# Altium project SPEC_A7.PrjPcb (part 7 of 7)

## Sheet PPS_IN.SchDoc: SPEC-A7
size 420 x 297 mm; Author: G.Kasprowicz; CompanyName: WUT ISE; DrawnBy: G.Kasprowicz; Organization: WUT ISE; Address1: PW ISE; Address2: Nowowiejska 15/19 00-665 Warsaw; Address3: gkasprow@gmail.com; Revision: 2; SheetNumber: 18; SheetTotal: 18; ModifiedBy: -; CheckedDate: -; Title2: PPS IN; DivGrp: WUT ISE; Designer: G.Kasprowicz; ModifiedDate: -; ProjectName: Sensor Box
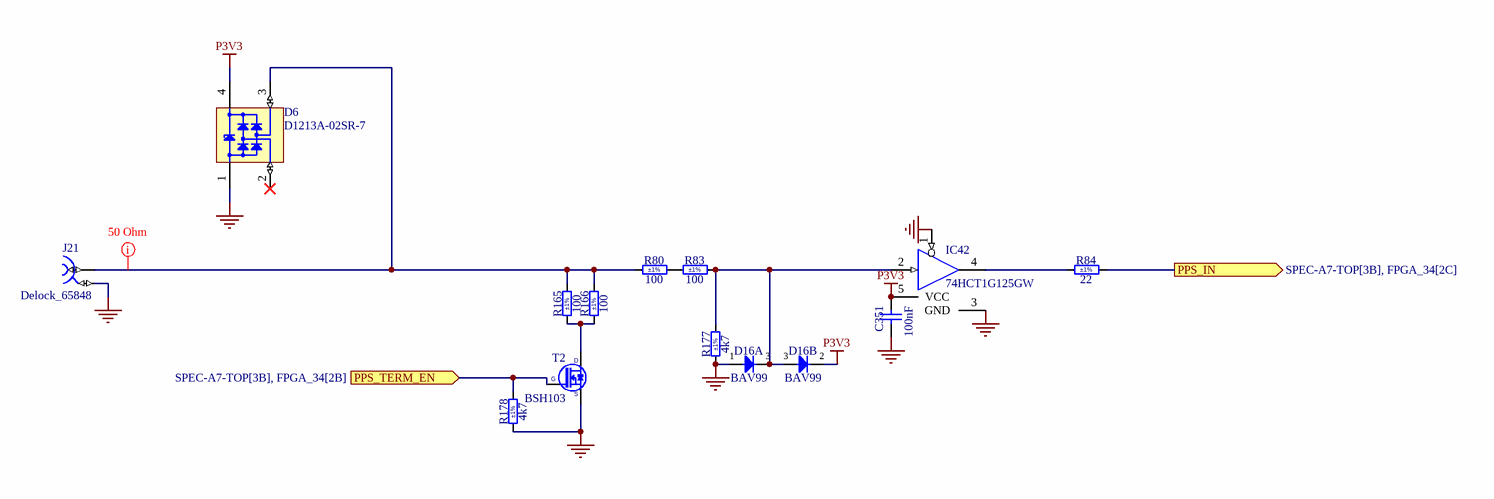
[diagram p17: PPS_IN.SchDoc]

### Parts
C351  100nF  [CAPC0603X33N]
D6  D1213A-02SR-7  [SOT190P238X100-4N]
D16  BAV99  [SOT95P240X110-3N]  (parts A,B of 2)
IC42  74HCT1G125GW  [SOT65P210X110-5N]
J21  Delock_65848  [Delock_65848]
R80  100  Tolerance: ±1%  [RESC1005X40N]
R83  100  Tolerance: ±1%  [RESC1005X40N]
R84  22  Tolerance: ±1%  [RESC1005X40N]
R165  100  Tolerance: ±1%  [RESC1005X40N]
R166  100  Tolerance: ±1%  [RESC1005X40N]
R177  4k7  Tolerance: ±1%  [RESC1005X40N]
R178  4k7  Tolerance: ±1%  [RESC1005X40N]
T2  BSH103  [SOT95P230X110-3N]

### Ports
PPS_IN (out, see SPEC-A7-TOP[3B], FPGA_34[2C]), PPS_TERM_EN (in, see SPEC-A7-TOP[3B], FPGA_34[2B])

### Nets
GND: C351.1 D6.1(GND) D16.1(A) IC42.1(~{G}) IC42.3(GND) J21.2 R177.1 R178.1 T2.2(S)
P3V3: C351.2 D6.4(VCC) D16.2(C) IC42.5(VCC)
PPS_IN: R84.2 ; port PPS_IN
NetD6_3: D6.3(I/O2) J21.1 R80.1 R165.2 R166.2
NetD16_3: D16.3(COMAC) IC42.2(IN) R83.2 R177.2
NetIC4_L2: R178.2 T2.1(G) ; port PPS_TERM_EN
NetIC42_4: IC42.4(OUT) R84.1
NetR80_2: R80.2 R83.1
NetR165_1: R165.1 R166.1 T2.3(D)

Not connected (* = marked no-connect by the designer): D6 2(I/O1)*

### Layout directives
net class 50_Ohm: NetD6_3

### Notes on the sheet
- Project/Equipment
- Document
- Designer
- Drawn by
- Check.by
- Copyright WUT ISE 2024.
  This documentation describes Open Hardware and is licensed under the CERN OHL v.2. You may redistribute and modify this documentation under the terms of the CERN OHL v.2. (http://ohwr.org/CERNOHL). This documentation is distributed WITHOUT ANY EXPRESS OR IMPLIED WARRANTY, INCLUDING OF MERCHANTABILITY, SATISFACTORY QUALITY AND FITNESS FOR A PARTICULAR PURPOSE. Please see the CERN OHL v.2 for applicable conditions.
- Contact
- File
- Last Mod.
- Print Date
- Sheet
- Size
- A3
- of
- Rev

### Library data of the parts
C351 = CC0201_100NF_6.3V_10%_X5R: as C57-C66 on sheet FPGA_PWR_CONFIG; Part Number: CC0201_100NF_6.3V_10%_X5R; Component Kind: Standard; Component Type: Standard; Pin Count: 2; Value: 100nF; Status: Not Recommended; Manufacturer Part Number: CC0201_100NF_6.3V_10%_X5R; Case: 0201; Mounted: Yes; Socket: No; SMD: Yes; Sense: No; Manufacturer1 Example: AVX; Manufacturer1 ComponentHeight: 0.33mm; HelpURL: \\cern.ch\dfs\Applications\Altium\Datasheets\CC0201_X5R_AVX.pdf; Author: CERN DEM JLC; CreateDate: 03.12.2007; LatestRevisionDate: 03.12.2007
D6 = CMP-004-00039-1: D1213A-02SR Series 400 mW Uni-Directional Surface Mount TVS Diode - SOT-143; Mounting Technology: Surface Mount; Case/Package: SOT-143; Max Operating Temperature: 150°C; Pins: 4; Min Operating Temperature: -65°C
D16 = BAV99: Serial Diode; Part Description: Dual Series Signal Diode; Manufacturer: FAIRCHILD SEMICONDUCTOR; Voltage: 70V; Power: 350mW; PressFit: No; Bonding: No; Part Number: BAV99; Component Kind: Standard; Component Type: Standard; Device: BAV99; PackageDescription: SOT, 0.95mm Pitch; 3 Pin, 1.40mm W X 3.00mm L X 1.10mm H body, IPC Medium Density; Manufacturer Part Number: BAV99; Pin Count: 3; Case: SOT23-3; Mounted: Yes; Socket: No; SMD: Yes; Sense: No; ComponentHeight: 1.1mm; HelpURL: \\cern.ch\dfs\Applications\Altium\Datasheets\BAV99.pdf; Author: CERN DEM JLC; CreateDate: 06.05.2008; LatestRevisionDate: 27.09.2012
IC42 = 74HCT1G125GW: Single Bus Buffer Gate With 3-State Output; Part Description: Bus Buffer/Line Driver 3-State; Manufacturer: NEXPERIA; PressFit: No; Bonding: No; Part Number: 74HCT1G125GW; Component Kind: Standard; Component Type: Standard; Device: 74HCT1G125GW; PackageDescription: SOT353, SC70-5, 0.65mm Pitch; 5 Pin, 1.25mm W X 2.00mm L X 1.10mm H body, IPC Medium Density; Manufacturer Part Number: 74HCT1G125GW; Pin Count: 5; Case: SOT353; Mounted: Yes; Socket: No; SMD: Yes; Sense: No; ComponentHeight: 1.1mm; Author: CERN DEM JMW; HelpURL: \\cern.ch\dfs\Applications\Altium\Datasheets\74HCT1G125GW.pdf; CreateDate: 06.08.2020; LatestRevisionDate: 06.08.2020
J21 = CMP-002-04652-1: SMA connector Delock 65848
R80 R83 R165 R166 = R0402_100R_1%_0.0625W_100PPM: Resistor - 1%; Part Description: General Purpose Thick Film Chip Resistor; Manufacturer: GENERIC; Manufacturer1 Part Number: 232270671001L; TC: ±100ppm/°C; PressFit: No; Part Number: R0402_100R_1%_0.0625W_100PPM; Component Kind: Standard; Component Type: Standard; Pin Count: 2; Value: 100; Status: Not Recommended; Power: 0.0625W; Manufacturer Part Number: R0402_100R_1%_0.0625W_100PPM; Case: 0402; Mounted: Yes; Sense: No; Socket: No; SMD: Yes; Manufacturer1 Example: YAGEO PHYCOMP; Manufacturer1 ComponentHeight: 0.4mm; HelpURL: \\cern.ch\dfs\Applications\Altium\Datasheets\R0402_Phycomp_RC0402.pdf; Author: CERN DEM JLC; CreateDate: 03.12.2007; LatestRevisionDate: 17.10.2012
R84 = R0402_22R_1%_0.0625W_100PPM: Resistor - 1%; Part Description: General Purpose Thick Film Chip Resistor; Manufacturer: GENERIC; Manufacturer1 Part Number: 232270672209L; TC: ±100ppm/°C; PressFit: No; Part Number: R0402_22R_1%_0.0625W_100PPM; Component Kind: Standard; Component Type: Standard; Pin Count: 2; Value: 22; Status: Not Recommended; Power: 0.0625W; Manufacturer Part Number: R0402_22R_1%_0.0625W_100PPM; Case: 0402; Mounted: Yes; Sense: No; Socket: No; SMD: Yes; Manufacturer1 Example: YAGEO PHYCOMP; Manufacturer1 ComponentHeight: 0.4mm; HelpURL: \\cern.ch\dfs\Applications\Altium\Datasheets\R0402_Phycomp_RC0402.pdf; Author: CERN DEM JLC; CreateDate: 03.12.2007; LatestRevisionDate: 17.10.2012
R177 R178 = R0402_4K7_1%_0.0625W_100PPM: as R45-R47 on sheet FPGA_PWR_CONFIG; Part Number: R0402_4K7_1%_0.0625W_100PPM; Component Kind: Standard; Component Type: Standard; Pin Count: 2; Value: 4k7; Status: Not Recommended; Power: 0.0625W; Manufacturer Part Number: R0402_4K7_1%_0.0625W_100PPM; Case: 0402; Mounted: Yes; Sense: No; Socket: No; SMD: Yes; Manufacturer1 Example: YAGEO PHYCOMP; Manufacturer1 ComponentHeight: 0.4mm; HelpURL: \\cern.ch\dfs\Applications\Altium\Datasheets\R0402_Phycomp_RC0402.pdf; Author: CERN DEM JLC; CreateDate: 03.12.2007; LatestRevisionDate: 17.10.2012
T2 = BSH103: N-CHANNEL MOSFET WITH DIODE; Part Description: 30V 850mA N-Channel Enhancement Mode Field-Effect Transistor; Manufacturer: NEXPERIA; PressFit: No; Bonding: No; Part Number: BSH103; Component Kind: Standard; Component Type: Standard; Device: BSH103; PackageDescription: SOT23, 3 pin, Pitch 0.95mm - 1.3mm W X 2.9mm L X 1.1mm H, IPC Medium Density; Manufacturer Part Number: BSH103; Pin Count: 3; Case: SOT23-3; Mounted: Yes; Socket: No; SMD: Yes; Sense: No; ComponentHeight: 1.1mm; HelpURL: \\cern.ch\dfs\Applications\Altium\Datasheets\BSH103.pdf; Author: CERN DEM JLC; CreateDate: 16.03.2010; LatestRevisionDate: 20.06.2017

## Nets that join several sheets
GND: Clocks_PLL (113 pins), FPGA_14_15 (13 pins), DIFF_DELAY_FANOUT (61 pins), VCXO_25M_DDMTD (25 pins), VCXO_25M_PTP (22 pins), SFP (59 pins), FPGA_34 (6 pins), USB_Serial_Quad (61 pins), XO_125M (5 pins), FPGA_PWR_CONFIG (179 pins), Ext_connectors (13 pins), PCIe (23 pins), Power (105 pins), Misc (12 pins), TOD (14 pins), PPS_IN (9 pins)
MGTAVCC: FPGA_PWR_CONFIG (10 pins), Power (R180.2)
MGTAVTT: FPGA_PWR_CONFIG (11 pins), FPGA_MGT (R42.2), Power (R181.2 T3.1 TP9.1)
P1V0: FPGA_PWR_CONFIG (41 pins), Power (R78.2 T1.1 TP7.1)
P1V8: FPGA_PWR_CONFIG (14 pins), Power (R15.2 R179.2 T4.1 TP10.1)
P2V5: FPGA_PWR_CONFIG (20 pins), Power (R183.2 T5.1 TP11.1), Misc (R125.2 R126.2 R127.2)
P3V0_REF: VCXO_25M_DDMTD (C138.2 C345.2 IC7.7 IC48.6), VCXO_25M_PTP (C149.2 IC10.7)
P3V3: FPGA_14_15 (C329.2 IC41.1 IC41.3), DIFF_DELAY_FANOUT (15 pins), SFP (16 pins), FPGA_34 (C33.2 IC38.8 R40.2 R41.2), USB_Serial_Quad (11 pins), XO_125M (FB6.1), FPGA_PWR_CONFIG (53 pins), Ext_connectors (J20.26), Power (12 pins), Misc (6 pins), TOD (7 pins), PPS_IN (C351.2 D6.4 D16.2 IC42.5)
P3V6_CLK: Clocks_PLL (FB32.1 FB33.1 FB34.1), VCXO_25M_DDMTD (5 pins), VCXO_25M_PTP (FB28.2 FB29.2), Power (R184.2)
P12V0: Ext_connectors (J20.23 J20.24 J20.25), PCIe (5 pins), Power (31 pins)
10M_OUT_SE: DIFF_DELAY_FANOUT (R167.1), FPGA_34 (IC4.N4)
62_5MHZ_N: Clocks_PLL (IC15.47), FPGA_14_15 (IC4.C13)
62_5MHZ_P: Clocks_PLL (IC15.48), FPGA_14_15 (IC4.D13)
125M_CLK_N: XO_125M (R55.2 Y2.5), FPGA_MGT (C45.1 C50.1)
125M_CLK_P: XO_125M (R56.2 Y2.4), FPGA_MGT (C44.1 C48.1)
CFG_TCK: USB_Serial_Quad (IC31.4), FPGA_PWR_CONFIG (D2.3 IC4.F8 J6.6)
CFG_TDI: USB_Serial_Quad (IC31.5), FPGA_PWR_CONFIG (D3.3 IC4.T9 J6.10)
CFG_TDO: USB_Serial_Quad (IC33.4), FPGA_PWR_CONFIG (D3.2 IC4.T8 J6.8)
CFG_TMS: USB_Serial_Quad (IC33.5), FPGA_PWR_CONFIG (D2.2 IC4.R8 J6.4)
CLK_25M: Clocks_PLL (IC14.64), VCXO_25M_PTP (C151.2)
CLK_25M_DMTD: FPGA_14_15 (IC4.T14), VCXO_25M_DDMTD (Y1.4)
CLK_125M_N: FPGA_14_15 (IC4.D16), FPGA_MGT (C50.2)
CLK_125M_P: FPGA_14_15 (IC4.E16), FPGA_MGT (C48.2)
DAC_LDAC: FPGA_14_15 (IC4.U12), VCXO_25M_PTP (IC10.2)
DAC_SCLK: FPGA_14_15 (IC4.V14), VCXO_25M_PTP (IC10.4)
DAC_SDI: FPGA_14_15 (IC4.T13), VCXO_25M_PTP (IC10.6)
DAC_SYNC: FPGA_14_15 (IC4.V13), VCXO_25M_PTP (IC10.5)
DDMTD_LDAC: FPGA_14_15 (IC4.N17), VCXO_25M_DDMTD (IC7.2)
DDMTD_SCLK: FPGA_14_15 (IC4.K17), VCXO_25M_DDMTD (IC7.4)
DDMTD_SDI: FPGA_14_15 (IC4.L18), VCXO_25M_DDMTD (IC7.6)
DDMTD_SYNC: FPGA_14_15 (IC4.M17), VCXO_25M_DDMTD (IC7.5)
DELAY_EN: FPGA_14_15 (IC4.J18), DIFF_DELAY_FANOUT (IC20.2)
DELAY_Q0_N: DIFF_DELAY_FANOUT (IC23.11), Ext_connectors (J18.18)
DELAY_Q0_P: DIFF_DELAY_FANOUT (IC23.12), Ext_connectors (J18.17)
DELAY_Q1_N: DIFF_DELAY_FANOUT (IC25.11), Ext_connectors (J18.24)
DELAY_Q1_P: DIFF_DELAY_FANOUT (IC25.12), Ext_connectors (J18.23)
DELAY_SCLK: FPGA_14_15 (IC4.K18), DIFF_DELAY_FANOUT (IC20.5)
DELAY_SDIN: FPGA_14_15 (IC4.J14), DIFF_DELAY_FANOUT (IC20.4)
DELAY_SLOAD: FPGA_14_15 (IC4.M16), DIFF_DELAY_FANOUT (IC20.3)
DLY0_SE_FB: FPGA_14_15 (IC4.P14), DIFF_DELAY_FANOUT (IC24.6)
DLY1_SE_FB: FPGA_14_15 (IC4.R15), DIFF_DELAY_FANOUT (IC26.6)
EXT_CLK_0_N: Clocks_PLL (IC14.55), Ext_connectors (J18.3)
EXT_CLK_0_P: Clocks_PLL (IC14.56), Ext_connectors (J18.2)
EXT_CLK_1_N: Clocks_PLL (IC14.52), Ext_connectors (J18.6)
EXT_CLK_1_P: Clocks_PLL (IC14.53), Ext_connectors (J18.5)
EXT_CLK_4_N: Clocks_PLL (IC14.25), Ext_connectors (J18.21)
EXT_CLK_4_P: Clocks_PLL (IC14.26), Ext_connectors (J18.20)
EXT_CLK_5_N: Clocks_PLL (IC14.28), Ext_connectors (J18.15)
EXT_CLK_5_P: Clocks_PLL (IC14.29), Ext_connectors (J18.14)
EXT_CLK_6_N: Clocks_PLL (IC14.47), Ext_connectors (J18.9)
EXT_CLK_6_P: Clocks_PLL (IC14.48), Ext_connectors (J18.8)
EXT_CLK_9_N: Clocks_PLL (IC14.36), Ext_connectors (J18.12)
EXT_CLK_9_P: Clocks_PLL (IC14.35), Ext_connectors (J18.11)
EXT_CLK_N: Clocks_PLL (IC13.9), FPGA_14_15 (IC4.D14)
EXT_CLK_P: Clocks_PLL (IC13.8), FPGA_14_15 (IC4.E13)
EXT_PLL_CS: Clocks_PLL (IC15.17), FPGA_34 (IC4.R3)
EXT_PLL_LOCK: Clocks_PLL (IC15.3), FPGA_34 (IC4.L3)
EXT_PLL_REFSEL: Clocks_PLL (IC15.7), FPGA_34 (IC4.L4)
EXT_PLL_SCLK: Clocks_PLL (IC15.16), FPGA_34 (IC4.T2)
EXT_PLL_SDI: Clocks_PLL (IC15.22), FPGA_34 (IC4.U4)
EXT_PLL_SDO: Clocks_PLL (IC15.21), FPGA_34 (IC4.V4)
EXT_PLL_STAT: Clocks_PLL (IC15.6), FPGA_34 (IC4.R1)
EXT_PLL_SYNC: Clocks_PLL (IC15.8), FPGA_34 (IC4.R2)
EXT_RESET: Clocks_PLL (IC15.23 IC15.24 R67.2), FPGA_34 (IC4.V6)
FPGA_GCLK_N: Clocks_PLL (IC14.34), FPGA_14_15 (IC4.D15)
FPGA_GCLK_P: Clocks_PLL (IC14.33), FPGA_14_15 (IC4.E15)
GPIO0: FPGA_34 (IC4.M1), Ext_connectors (J20.17)
GPIO1: FPGA_34 (IC4.V3), Ext_connectors (J20.18)
GPIO2: FPGA_34 (IC4.U2), Ext_connectors (J20.19)
GPIO3: FPGA_34 (IC4.N1), Ext_connectors (J20.20)
GPIO4: FPGA_34 (IC4.P1), Ext_connectors (J20.21)
GTP_CLK_REF_N: Clocks_PLL (IC14.45), FPGA_MGT (C47.1)
GTP_CLK_REF_P: Clocks_PLL (IC14.46), FPGA_MGT (C46.1)
HW_REV0: FPGA_14_15 (IC4.D10), Misc (R125.1 R128.2)
HW_REV1: FPGA_14_15 (IC4.A14), Misc (R126.1 R129.2)
HW_REV2: FPGA_14_15 (IC4.A13), Misc (R127.1 R130.2)
I2C_SCL: FPGA_34 (IC4.N2 IC38.6 R41.1), Ext_connectors (J18.26)
I2C_SDA: FPGA_34 (IC4.M2 IC38.5 R40.1), Ext_connectors (J18.25)
LED0: FPGA_14_15 (IC4.H14), Misc (T11.1)
LED1: FPGA_14_15 (IC4.G14), Misc (T12.1)
LED2: FPGA_14_15 (IC4.H17), Misc (T13.1)
LED3: FPGA_14_15 (IC4.E18), Misc (T14.1)
LMX_CS: Clocks_PLL (IC16.24), FPGA_34 (IC4.K2)
LMX_SCK: Clocks_PLL (IC16.16), FPGA_34 (IC4.K1)
LMX_SDI: Clocks_PLL (IC16.17), FPGA_34 (IC4.K5)
LMX_SYNC: Clocks_PLL (IC16.5), FPGA_34 (IC4.K6)
LOCK: FPGA_14_15 (IC4.B17), Misc (J19.3)
NetC134_2: USB_Serial_Quad (T9.1), FPGA_PWR_CONFIG (C134.2 J6.13 R49.1)
NetIC4_L2: FPGA_34 (IC4.L2), PPS_IN (R178.2 T2.1)
NetIC4_T3: FPGA_34 (IC4.T3), TOD (R153.2 T10.1)
NetIC16_8: Clocks_PLL (IC16.8), VCXO_25M_PTP (R53.2)
OE_125M: FPGA_14_15 (IC4.F14), XO_125M (Y2.1)
ONE_WIRE: FPGA_14_15 (IC4.U14), Misc (IC37.1 R124.1)
OUT_2_N: Clocks_PLL (IC14.42), DIFF_DELAY_FANOUT (IC21.4 R87.1 R141.1)
OUT_2_P: Clocks_PLL (IC14.43), DIFF_DELAY_FANOUT (IC21.3 R86.1 R139.1)
OUT_3_N: Clocks_PLL (IC14.39), DIFF_DELAY_FANOUT (IC22.4 R90.1 R144.1)
OUT_3_P: Clocks_PLL (IC14.40), DIFF_DELAY_FANOUT (IC22.3 R89.1 R143.1)
PCIe_PER0_N: FPGA_MGT (IC4.E3), PCIe (J14.b15)
PCIe_PER0_P: FPGA_MGT (IC4.E4), PCIe (J14.b14)
PCIe_PER1_N: FPGA_MGT (IC4.A3), PCIe (J14.b20)
PCIe_PER1_P: FPGA_MGT (IC4.A4), PCIe (J14.b19)
PCIe_PET0_N: FPGA_MGT (C51.2), PCIe (J14.a17)
PCIe_PET0_P: FPGA_MGT (C49.2), PCIe (J14.a16)
PCIe_PET1_N: FPGA_MGT (C55.2), PCIe (J14.a22)
PCIe_PET1_P: FPGA_MGT (C53.2), PCIe (J14.a21)
PCIe_REFCLK_N: FPGA_MGT (C336.1), PCIe (J14.a14)
PCIe_REFCLK_P: FPGA_MGT (C335.1), PCIe (J14.a13)
PCIe_RST: FPGA_34 (IC4.R6), PCIe (R204.1)
PLL_CS: Clocks_PLL (IC14.17), FPGA_14_15 (IC4.V9)
PLL_LOCK: Clocks_PLL (IC14.3), FPGA_14_15 (IC4.U16)
PLL_REFSEL: Clocks_PLL (IC14.7), FPGA_14_15 (IC4.U15)
PLL_RESET: Clocks_PLL (IC14.23 IC14.24 R66.2), FPGA_14_15 (IC4.U11)
PLL_SCLK: Clocks_PLL (IC14.16), FPGA_14_15 (IC4.V11)
PLL_SDI: Clocks_PLL (IC14.22), FPGA_14_15 (IC4.U10)
PLL_SDO: Clocks_PLL (IC14.21), FPGA_14_15 (IC4.U9)
PLL_STAT: Clocks_PLL (IC14.6), FPGA_14_15 (IC4.V16)
PLL_SYNC: Clocks_PLL (IC14.8), FPGA_14_15 (IC4.P16)
PPS_IN: FPGA_34 (IC4.P3), PPS_IN (R84.2)
PPS_OUT_SE: DIFF_DELAY_FANOUT (R168.1), FPGA_34 (IC4.M4)
QSPI_CS: FPGA_14_15 (IC4.L15), FPGA_PWR_CONFIG (IC6.1 IC17.10 R45.2)
QSPI_DQ0: FPGA_14_15 (IC4.K16), FPGA_PWR_CONFIG (IC6.5 IC17.3)
QSPI_DQ1: FPGA_14_15 (IC4.L17), FPGA_PWR_CONFIG (IC6.2 IC17.9)
QSPI_DQ2: FPGA_14_15 (IC4.J15), FPGA_PWR_CONFIG (IC6.3 R46.2)
QSPI_DQ3: FPGA_14_15 (IC4.J16), FPGA_PWR_CONFIG (IC6.7 R47.2)
RESET: FPGA_14_15 (IC4.K15), Misc (J19.1)
RESV_I: FPGA_14_15 (IC4.H18), Misc (J19.5)
RESV_O: FPGA_14_15 (IC4.F15), Misc (J19.7)
RGMII_RX_CLK: FPGA_34 (R163.2), Ext_connectors (J20.3)
RGMII_RX_DV: FPGA_34 (R159.2), Ext_connectors (J20.2)
RGMII_RXD0: FPGA_34 (R160.2), Ext_connectors (J20.5)
RGMII_RXD1: FPGA_34 (R161.2), Ext_connectors (J20.6)
RGMII_RXD2: FPGA_34 (R164.2), Ext_connectors (J20.7)
RGMII_RXD3: FPGA_34 (R162.2), Ext_connectors (J20.8)
RGMII_TX_CLK: FPGA_34 (IC4.N3), Ext_connectors (J20.16)
RGMII_TX_EN: FPGA_34 (IC4.N6), Ext_connectors (J20.15)
RGMII_TXD0: FPGA_34 (IC4.M6), Ext_connectors (J20.10)
RGMII_TXD1: FPGA_34 (IC4.V2), Ext_connectors (J20.11)
RGMII_TXD2: FPGA_34 (IC4.P5), Ext_connectors (J20.12)
RGMII_TXD3: FPGA_34 (IC4.T5), Ext_connectors (J20.13)
RX: SPEC-A7-TOP (R1.2), FPGA_14_15 (IC4.R16)
RXD_USB: SPEC-A7-TOP (R2.1), USB_Serial_Quad (IC36.5 R173.1 TP16.1)
SFP0_DISABLE: FPGA_14_15 (IC4.U17), SFP (J12.3)
SFP0_FAULT: FPGA_14_15 (IC4.V17), SFP (J12.2 R94.1)
SFP0_I_N: SFP (J12.19), FPGA_MGT (IC4.D1)
SFP0_I_P: SFP (J12.18), FPGA_MGT (IC4.D2)
SFP0_LOSE: FPGA_14_15 (IC4.P18), SFP (J12.8 R95.1)
SFP0_MODE0: FPGA_14_15 (IC4.R18), SFP (J12.6 R96.1)
SFP0_MODE1: FPGA_14_15 (IC4.T18), SFP (J12.5)
SFP0_MODE2: FPGA_14_15 (IC4.T17), SFP (J12.4)
SFP0_O_N: SFP (J12.12), FPGA_MGT (IC4.C3)
SFP0_O_P: SFP (J12.13), FPGA_MGT (IC4.C4)
SFP0_RS: FPGA_14_15 (IC4.N16), SFP (J12.7 R98.2)
SFP1_DISABLE: FPGA_14_15 (IC4.M15), SFP (J13.3)
SFP1_FAULT: FPGA_14_15 (IC4.L14), SFP (J13.2 R100.1)
SFP1_I_N: SFP (J13.19), FPGA_MGT (IC4.B1)
SFP1_I_P: SFP (J13.18), FPGA_MGT (IC4.B2)
SFP1_LOSE: FPGA_14_15 (IC4.P15), SFP (J13.8 R101.1)
SFP1_MODE0: FPGA_14_15 (IC4.T12), SFP (J13.6 R102.1)
SFP1_MODE1: FPGA_14_15 (IC4.N14), SFP (J13.5)
SFP1_MODE2: FPGA_14_15 (IC4.M14), SFP (J13.4)
SFP1_O_N: SFP (J13.12), FPGA_MGT (IC4.G3)
SFP1_O_P: SFP (J13.13), FPGA_MGT (IC4.G4)
SFP1_RS: FPGA_14_15 (IC4.R13), SFP (J13.7 R103.2)
SFP_0.LED: FPGA_14_15 (IC4.G16), SFP (T7.1)
SFP_1.LED: FPGA_14_15 (IC4.G15), SFP (T8.1)
SYNC_DATA0_N: FPGA_14_15 (IC4.A9), DIFF_DELAY_FANOUT (IC21.2 R85.1)
SYNC_DATA0_P: FPGA_14_15 (IC4.B9), DIFF_DELAY_FANOUT (IC21.1 R85.2)
SYNC_DATA1_N: FPGA_14_15 (IC4.C8), DIFF_DELAY_FANOUT (IC22.2 R88.1)
SYNC_DATA1_P: FPGA_14_15 (IC4.D8), DIFF_DELAY_FANOUT (IC22.1 R88.2)
TOD_IN: FPGA_34 (IC4.P4), TOD (R149.2)
TOD_OUT: FPGA_34 (IC4.V8), TOD (IC39.1)
TX: SPEC-A7-TOP (R2.2), FPGA_14_15 (IC4.R17)
TXD_USB: SPEC-A7-TOP (R1.1), USB_Serial_Quad (IC36.4 R171.2 TP17.1)

## Assembly variants
Professional: not fitted C44 C45 IC9 IC12 J19 OSC2 R55 R56 R125 R127 R129 R137 R138 R139 R140 R141 R142 R143 R144 R167 R168 R171 R173 R174 R176 R206 W1 W2 W3 W4